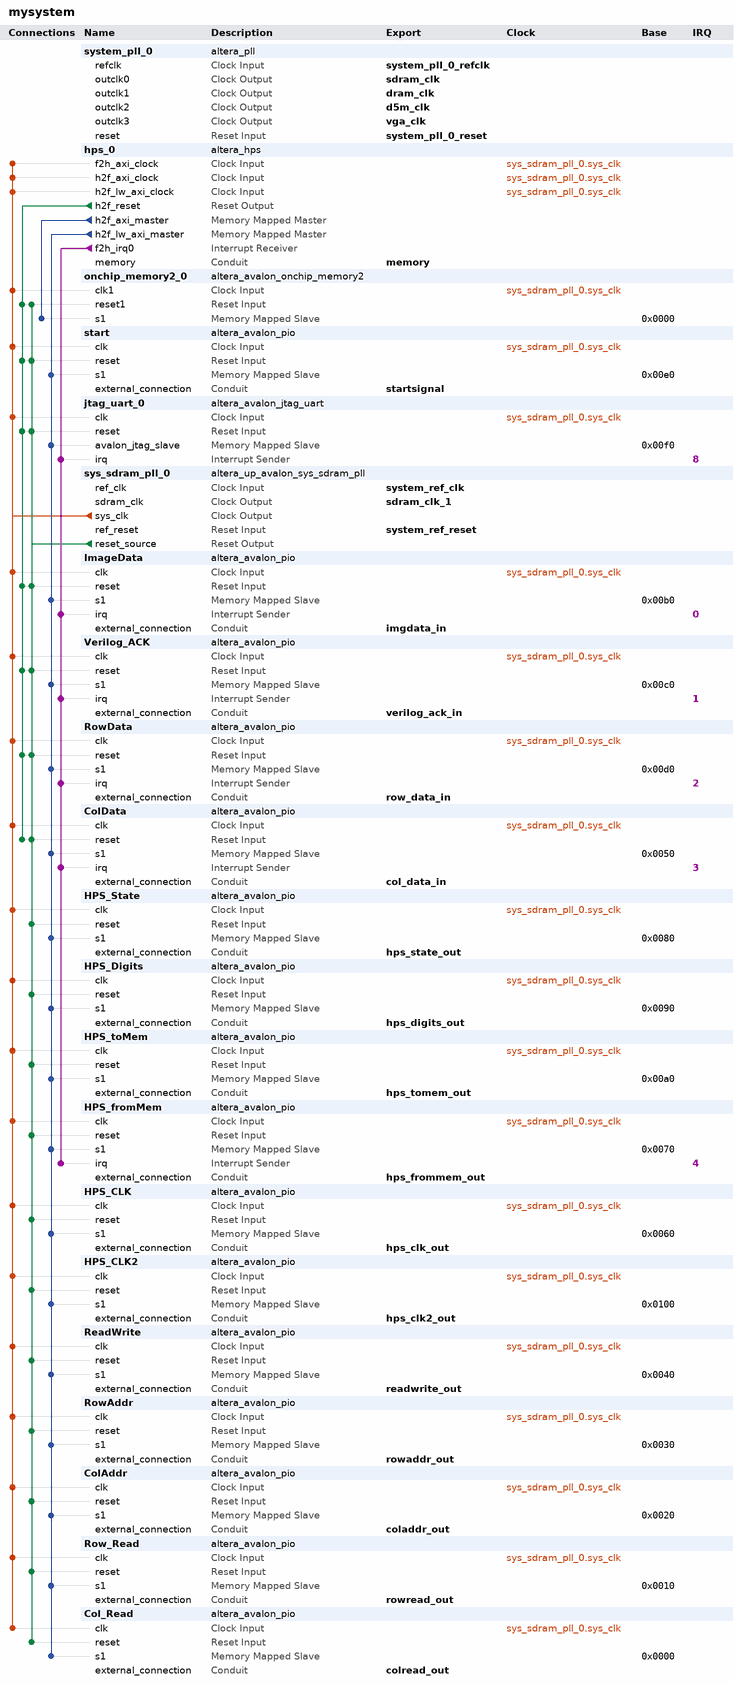
[diagram p0: system contents]
# Platform Designer (Qsys) system mysystem, Cyclone V 5CSEMA5F31C6
# Parameters at their usual value, and those the tool derives, are not listed.
package require -exact qsys 13.1
create_system mysystem
set_project_property DEVICE_FAMILY {Cyclone V}
set_project_property DEVICE 5CSEMA5F31C6

add_instance system_pll_0 altera_pll 13.1
set_instance_parameter_value system_pll_0 gui_device_speed_grade 2
set_instance_parameter_value system_pll_0 gui_pll_mode {Integer-N PLL}
set_instance_parameter_value system_pll_0 gui_reference_clock_frequency 50.0
set_instance_parameter_value system_pll_0 gui_operation_mode direct
set_instance_parameter_value system_pll_0 gui_use_locked false
set_instance_parameter_value system_pll_0 gui_number_of_clocks 4
set_instance_parameter_value system_pll_0 gui_output_clock_frequency0 100.0
set_instance_parameter_value system_pll_0 gui_output_clock_frequency1 100.0
set_instance_parameter_value system_pll_0 gui_ps_units1 degrees
set_instance_parameter_value system_pll_0 gui_phase_shift_deg1 -90.0
set_instance_parameter_value system_pll_0 gui_output_clock_frequency2 25.0
set_instance_parameter_value system_pll_0 gui_output_clock_frequency3 25.0

add_instance hps_0 altera_hps 13.1
set_instance_parameter_value hps_0 MEM_VENDOR JEDEC
set_instance_parameter_value hps_0 MEM_CLK_FREQ_MAX 400.0
set_instance_parameter_value hps_0 MEM_ROW_ADDR_WIDTH 12
set_instance_parameter_value hps_0 MEM_COL_ADDR_WIDTH 8
set_instance_parameter_value hps_0 MEM_DQ_WIDTH 8
set_instance_parameter_value hps_0 MEM_BANKADDR_WIDTH 3
set_instance_parameter_value hps_0 MEM_DRV_STR RZQ/6
set_instance_parameter_value hps_0 MEM_RTT_NOM RZQ/6
set_instance_parameter_value hps_0 MEM_RTT_WR {Dynamic ODT off}
set_instance_parameter_value hps_0 MEM_WTCL 6
set_instance_parameter_value hps_0 MEM_TCL 7
set_instance_parameter_value hps_0 TIMING_TIS 175
set_instance_parameter_value hps_0 TIMING_TIH 250
set_instance_parameter_value hps_0 TIMING_TDS 50
set_instance_parameter_value hps_0 TIMING_TDH 125
set_instance_parameter_value hps_0 TIMING_TDQSQ 120
set_instance_parameter_value hps_0 TIMING_TDQSCK 400
set_instance_parameter_value hps_0 TIMING_TQSH 0.38
set_instance_parameter_value hps_0 MEM_TINIT_US 499
set_instance_parameter_value hps_0 MEM_TMRD_CK 3
set_instance_parameter_value hps_0 MEM_TRAS_NS 40.0
set_instance_parameter_value hps_0 MEM_TRCD_NS 15.0
set_instance_parameter_value hps_0 MEM_TRP_NS 15.0
set_instance_parameter_value hps_0 MEM_TREFI_US 7.0
set_instance_parameter_value hps_0 MEM_TRFC_NS 75.0
set_instance_parameter_value hps_0 MEM_TWTR 2
set_instance_parameter_value hps_0 MEM_TFAW_NS 37.5
set_instance_parameter_value hps_0 REF_CLK_FREQ 125.0
set_instance_parameter_value hps_0 DEFAULT_FAST_SIM_MODEL true
set_instance_parameter_value hps_0 TIMING_BOARD_MAX_CK_DELAY 0.6
set_instance_parameter_value hps_0 TIMING_BOARD_MAX_DQS_DELAY 0.6
set_instance_parameter_value hps_0 TIMING_BOARD_SKEW_CKDQS_DIMM_MIN -0.01
set_instance_parameter_value hps_0 TIMING_BOARD_SKEW_CKDQS_DIMM_MAX 0.01
set_instance_parameter_value hps_0 TIMING_BOARD_SKEW_WITHIN_DQS 0.02
set_instance_parameter_value hps_0 TIMING_BOARD_SKEW_BETWEEN_DQS 0.02
set_instance_parameter_value hps_0 TIMING_BOARD_DQ_TO_DQS_SKEW 0.0
set_instance_parameter_value hps_0 TIMING_BOARD_AC_SKEW 0.02
set_instance_parameter_value hps_0 TIMING_BOARD_AC_TO_CK_SKEW 0.0
set_instance_parameter_value hps_0 MEM_CLK_FREQ 300.0
set_instance_parameter_value hps_0 HPS_PROTOCOL DDR3
set_instance_parameter_value hps_0 STM_Enable false
set_instance_parameter_value hps_0 F2S_Width 2
set_instance_parameter_value hps_0 S2F_Width 3
set_instance_parameter_value hps_0 LWH2F_Enable true
set_instance_parameter_value hps_0 F2SCLK_DBGRST_Enable false
set_instance_parameter_value hps_0 F2SCLK_WARMRST_Enable false
set_instance_parameter_value hps_0 F2SCLK_COLDRST_Enable false
set_instance_parameter_value hps_0 F2SINTERRUPT_Enable true
set_instance_parameter_value hps_0 EMAC1_PinMuxing Unused
set_instance_parameter_value hps_0 EMAC1_Mode N/A
set_instance_parameter_value hps_0 QSPI_PinMuxing Unused
set_instance_parameter_value hps_0 QSPI_Mode N/A
set_instance_parameter_value hps_0 SDIO_PinMuxing Unused
set_instance_parameter_value hps_0 SDIO_Mode N/A
set_instance_parameter_value hps_0 USB1_PinMuxing Unused
set_instance_parameter_value hps_0 USB1_Mode N/A
set_instance_parameter_value hps_0 SPIM1_PinMuxing Unused
set_instance_parameter_value hps_0 SPIM1_Mode N/A
set_instance_parameter_value hps_0 UART0_PinMuxing Unused
set_instance_parameter_value hps_0 UART0_Mode N/A
set_instance_parameter_value hps_0 I2C0_PinMuxing Unused
set_instance_parameter_value hps_0 I2C0_Mode N/A
set_instance_parameter_value hps_0 I2C1_PinMuxing Unused
set_instance_parameter_value hps_0 I2C1_Mode N/A
set_instance_parameter_value hps_0 S2FCLK_USER1CLK_FREQ 100
set_instance_parameter_value hps_0 FPGA_PERIPHERAL_OUTPUT_CLOCK_FREQ_EMAC0_MD_CLK 100
set_instance_parameter_value hps_0 FPGA_PERIPHERAL_OUTPUT_CLOCK_FREQ_EMAC0_GTX_CLK 100
set_instance_parameter_value hps_0 FPGA_PERIPHERAL_OUTPUT_CLOCK_FREQ_EMAC1_MD_CLK 100
set_instance_parameter_value hps_0 FPGA_PERIPHERAL_OUTPUT_CLOCK_FREQ_EMAC1_GTX_CLK 100

add_instance onchip_memory2_0 altera_avalon_onchip_memory2 13.1
set_instance_parameter_value onchip_memory2_0 dataWidth 32
set_instance_parameter_value onchip_memory2_0 dualPort false
set_instance_parameter_value onchip_memory2_0 initMemContent true
set_instance_parameter_value onchip_memory2_0 initializationFileName onchip_mem.hex
set_instance_parameter_value onchip_memory2_0 memorySize 16384

add_instance start altera_avalon_pio 13.1
set_instance_parameter_value start direction Output
set_instance_parameter_value start width 1

add_instance jtag_uart_0 altera_avalon_jtag_uart 13.1
set_instance_parameter_value jtag_uart_0 simInteractiveOptions NO_INTERACTIVE_WINDOWS

add_instance sys_sdram_pll_0 altera_up_avalon_sys_sdram_pll 13.1
set_instance_parameter_value sys_sdram_pll_0 gui_refclk 50.0
set_instance_parameter_value sys_sdram_pll_0 gui_outclk 50.0
set_instance_parameter_value sys_sdram_pll_0 CV_boards DE1-SoC

add_instance ImageData altera_avalon_pio 13.1
set_instance_parameter_value ImageData bitClearingEdgeCapReg true
set_instance_parameter_value ImageData captureEdge true
set_instance_parameter_value ImageData direction Input
set_instance_parameter_value ImageData edgeType FALLING
set_instance_parameter_value ImageData generateIRQ true
set_instance_parameter_value ImageData irqType EDGE
set_instance_parameter_value ImageData simDoTestBenchWiring true
set_instance_parameter_value ImageData width 32

add_instance Verilog_ACK altera_avalon_pio 13.1
set_instance_parameter_value Verilog_ACK bitClearingEdgeCapReg true
set_instance_parameter_value Verilog_ACK captureEdge true
set_instance_parameter_value Verilog_ACK direction Input
set_instance_parameter_value Verilog_ACK edgeType FALLING
set_instance_parameter_value Verilog_ACK generateIRQ true
set_instance_parameter_value Verilog_ACK irqType EDGE
set_instance_parameter_value Verilog_ACK simDoTestBenchWiring true
set_instance_parameter_value Verilog_ACK width 1

add_instance RowData altera_avalon_pio 13.1
set_instance_parameter_value RowData bitClearingEdgeCapReg true
set_instance_parameter_value RowData captureEdge true
set_instance_parameter_value RowData direction Input
set_instance_parameter_value RowData edgeType FALLING
set_instance_parameter_value RowData generateIRQ true
set_instance_parameter_value RowData irqType EDGE
set_instance_parameter_value RowData simDoTestBenchWiring true
set_instance_parameter_value RowData width 32

add_instance ColData altera_avalon_pio 13.1
set_instance_parameter_value ColData bitClearingEdgeCapReg true
set_instance_parameter_value ColData captureEdge true
set_instance_parameter_value ColData direction Input
set_instance_parameter_value ColData edgeType FALLING
set_instance_parameter_value ColData generateIRQ true
set_instance_parameter_value ColData irqType EDGE
set_instance_parameter_value ColData simDoTestBenchWiring true
set_instance_parameter_value ColData width 32

add_instance HPS_State altera_avalon_pio 13.1
set_instance_parameter_value HPS_State direction Output
set_instance_parameter_value HPS_State width 10

add_instance HPS_Digits altera_avalon_pio 13.1
set_instance_parameter_value HPS_Digits direction Output
set_instance_parameter_value HPS_Digits width 32

add_instance HPS_toMem altera_avalon_pio 13.1
set_instance_parameter_value HPS_toMem direction Output
set_instance_parameter_value HPS_toMem width 32

add_instance HPS_fromMem altera_avalon_pio 13.1
set_instance_parameter_value HPS_fromMem bitClearingEdgeCapReg true
set_instance_parameter_value HPS_fromMem captureEdge true
set_instance_parameter_value HPS_fromMem direction Input
set_instance_parameter_value HPS_fromMem edgeType FALLING
set_instance_parameter_value HPS_fromMem generateIRQ true
set_instance_parameter_value HPS_fromMem irqType EDGE
set_instance_parameter_value HPS_fromMem simDoTestBenchWiring true
set_instance_parameter_value HPS_fromMem width 32

add_instance HPS_CLK altera_avalon_pio 13.1
set_instance_parameter_value HPS_CLK direction Output
set_instance_parameter_value HPS_CLK width 1

add_instance HPS_CLK2 altera_avalon_pio 13.1
set_instance_parameter_value HPS_CLK2 direction Output
set_instance_parameter_value HPS_CLK2 width 1

add_instance ReadWrite altera_avalon_pio 13.1
set_instance_parameter_value ReadWrite direction Output
set_instance_parameter_value ReadWrite width 1

add_instance RowAddr altera_avalon_pio 13.1
set_instance_parameter_value RowAddr direction Output
set_instance_parameter_value RowAddr width 10

add_instance ColAddr altera_avalon_pio 13.1
set_instance_parameter_value ColAddr direction Output
set_instance_parameter_value ColAddr width 10

add_instance Row_Read altera_avalon_pio 13.1
set_instance_parameter_value Row_Read direction Output
set_instance_parameter_value Row_Read width 1

add_instance Col_Read altera_avalon_pio 13.1
set_instance_parameter_value Col_Read direction Output
set_instance_parameter_value Col_Read width 1

# connections
add_connection sys_sdram_pll_0.sys_clk Col_Read.clk clock
add_connection sys_sdram_pll_0.sys_clk ColAddr.clk clock
add_connection sys_sdram_pll_0.sys_clk ColData.clk clock
add_connection sys_sdram_pll_0.sys_clk hps_0.f2h_axi_clock clock
add_connection sys_sdram_pll_0.sys_clk hps_0.h2f_axi_clock clock
add_connection sys_sdram_pll_0.sys_clk hps_0.h2f_lw_axi_clock clock
add_connection sys_sdram_pll_0.sys_clk HPS_CLK2.clk clock
add_connection sys_sdram_pll_0.sys_clk HPS_CLK.clk clock
add_connection sys_sdram_pll_0.sys_clk HPS_Digits.clk clock
add_connection sys_sdram_pll_0.sys_clk HPS_fromMem.clk clock
add_connection sys_sdram_pll_0.sys_clk HPS_State.clk clock
add_connection sys_sdram_pll_0.sys_clk HPS_toMem.clk clock
add_connection sys_sdram_pll_0.sys_clk ImageData.clk clock
add_connection sys_sdram_pll_0.sys_clk jtag_uart_0.clk clock
add_connection sys_sdram_pll_0.sys_clk onchip_memory2_0.clk1 clock
add_connection sys_sdram_pll_0.sys_clk ReadWrite.clk clock
add_connection sys_sdram_pll_0.sys_clk Row_Read.clk clock
add_connection sys_sdram_pll_0.sys_clk RowAddr.clk clock
add_connection sys_sdram_pll_0.sys_clk RowData.clk clock
add_connection sys_sdram_pll_0.sys_clk start.clk clock
add_connection sys_sdram_pll_0.sys_clk Verilog_ACK.clk clock
add_connection hps_0.h2f_reset ColData.reset reset
add_connection hps_0.h2f_reset ImageData.reset reset
add_connection hps_0.h2f_reset jtag_uart_0.reset reset
add_connection hps_0.h2f_reset onchip_memory2_0.reset1 reset
add_connection hps_0.h2f_reset RowData.reset reset
add_connection hps_0.h2f_reset start.reset reset
add_connection hps_0.h2f_reset Verilog_ACK.reset reset
add_connection sys_sdram_pll_0.reset_source Col_Read.reset reset
add_connection sys_sdram_pll_0.reset_source ColAddr.reset reset
add_connection sys_sdram_pll_0.reset_source ColData.reset reset
add_connection sys_sdram_pll_0.reset_source HPS_CLK2.reset reset
add_connection sys_sdram_pll_0.reset_source HPS_CLK.reset reset
add_connection sys_sdram_pll_0.reset_source HPS_Digits.reset reset
add_connection sys_sdram_pll_0.reset_source HPS_fromMem.reset reset
add_connection sys_sdram_pll_0.reset_source HPS_State.reset reset
add_connection sys_sdram_pll_0.reset_source HPS_toMem.reset reset
add_connection sys_sdram_pll_0.reset_source ImageData.reset reset
add_connection sys_sdram_pll_0.reset_source jtag_uart_0.reset reset
add_connection sys_sdram_pll_0.reset_source onchip_memory2_0.reset1 reset
add_connection sys_sdram_pll_0.reset_source ReadWrite.reset reset
add_connection sys_sdram_pll_0.reset_source Row_Read.reset reset
add_connection sys_sdram_pll_0.reset_source RowAddr.reset reset
add_connection sys_sdram_pll_0.reset_source RowData.reset reset
add_connection sys_sdram_pll_0.reset_source start.reset reset
add_connection sys_sdram_pll_0.reset_source Verilog_ACK.reset reset
add_connection hps_0.h2f_axi_master onchip_memory2_0.s1 avalon
set_connection_parameter_value hps_0.h2f_axi_master/onchip_memory2_0.s1 baseAddress 0x0000
add_connection hps_0.h2f_lw_axi_master Col_Read.s1 avalon
set_connection_parameter_value hps_0.h2f_lw_axi_master/Col_Read.s1 baseAddress 0x0000
add_connection hps_0.h2f_lw_axi_master ColAddr.s1 avalon
set_connection_parameter_value hps_0.h2f_lw_axi_master/ColAddr.s1 baseAddress 0x0020
add_connection hps_0.h2f_lw_axi_master ColData.s1 avalon
set_connection_parameter_value hps_0.h2f_lw_axi_master/ColData.s1 baseAddress 0x0050
add_connection hps_0.h2f_lw_axi_master HPS_CLK2.s1 avalon
set_connection_parameter_value hps_0.h2f_lw_axi_master/HPS_CLK2.s1 baseAddress 0x0100
add_connection hps_0.h2f_lw_axi_master HPS_CLK.s1 avalon
set_connection_parameter_value hps_0.h2f_lw_axi_master/HPS_CLK.s1 baseAddress 0x0060
add_connection hps_0.h2f_lw_axi_master HPS_Digits.s1 avalon
set_connection_parameter_value hps_0.h2f_lw_axi_master/HPS_Digits.s1 baseAddress 0x0090
add_connection hps_0.h2f_lw_axi_master HPS_fromMem.s1 avalon
set_connection_parameter_value hps_0.h2f_lw_axi_master/HPS_fromMem.s1 baseAddress 0x0070
add_connection hps_0.h2f_lw_axi_master HPS_State.s1 avalon
set_connection_parameter_value hps_0.h2f_lw_axi_master/HPS_State.s1 baseAddress 0x0080
add_connection hps_0.h2f_lw_axi_master HPS_toMem.s1 avalon
set_connection_parameter_value hps_0.h2f_lw_axi_master/HPS_toMem.s1 baseAddress 0x00a0
add_connection hps_0.h2f_lw_axi_master ImageData.s1 avalon
set_connection_parameter_value hps_0.h2f_lw_axi_master/ImageData.s1 baseAddress 0x00b0
add_connection hps_0.h2f_lw_axi_master jtag_uart_0.avalon_jtag_slave avalon
set_connection_parameter_value hps_0.h2f_lw_axi_master/jtag_uart_0.avalon_jtag_slave baseAddress 0x00f0
add_connection hps_0.h2f_lw_axi_master ReadWrite.s1 avalon
set_connection_parameter_value hps_0.h2f_lw_axi_master/ReadWrite.s1 baseAddress 0x0040
add_connection hps_0.h2f_lw_axi_master Row_Read.s1 avalon
set_connection_parameter_value hps_0.h2f_lw_axi_master/Row_Read.s1 baseAddress 0x0010
add_connection hps_0.h2f_lw_axi_master RowAddr.s1 avalon
set_connection_parameter_value hps_0.h2f_lw_axi_master/RowAddr.s1 baseAddress 0x0030
add_connection hps_0.h2f_lw_axi_master RowData.s1 avalon
set_connection_parameter_value hps_0.h2f_lw_axi_master/RowData.s1 baseAddress 0x00d0
add_connection hps_0.h2f_lw_axi_master start.s1 avalon
set_connection_parameter_value hps_0.h2f_lw_axi_master/start.s1 baseAddress 0x00e0
add_connection hps_0.h2f_lw_axi_master Verilog_ACK.s1 avalon
set_connection_parameter_value hps_0.h2f_lw_axi_master/Verilog_ACK.s1 baseAddress 0x00c0
add_connection hps_0.f2h_irq0 ColData.irq interrupt
set_connection_parameter_value hps_0.f2h_irq0/ColData.irq irqNumber 3
add_connection hps_0.f2h_irq0 HPS_fromMem.irq interrupt
set_connection_parameter_value hps_0.f2h_irq0/HPS_fromMem.irq irqNumber 4
add_connection hps_0.f2h_irq0 ImageData.irq interrupt
set_connection_parameter_value hps_0.f2h_irq0/ImageData.irq irqNumber 0
add_connection hps_0.f2h_irq0 jtag_uart_0.irq interrupt
set_connection_parameter_value hps_0.f2h_irq0/jtag_uart_0.irq irqNumber 8
add_connection hps_0.f2h_irq0 RowData.irq interrupt
set_connection_parameter_value hps_0.f2h_irq0/RowData.irq irqNumber 2
add_connection hps_0.f2h_irq0 Verilog_ACK.irq interrupt
set_connection_parameter_value hps_0.f2h_irq0/Verilog_ACK.irq irqNumber 1

# exported interfaces
add_interface sdram_clk clock source
set_interface_property sdram_clk EXPORT_OF system_pll_0.outclk0
add_interface dram_clk clock source
set_interface_property dram_clk EXPORT_OF system_pll_0.outclk1
add_interface d5m_clk clock source
set_interface_property d5m_clk EXPORT_OF system_pll_0.outclk2
add_interface vga_clk clock source
set_interface_property vga_clk EXPORT_OF system_pll_0.outclk3
add_interface system_pll_0_refclk clock sink
set_interface_property system_pll_0_refclk EXPORT_OF system_pll_0.refclk
add_interface system_pll_0_reset reset sink
set_interface_property system_pll_0_reset EXPORT_OF system_pll_0.reset
add_interface memory conduit end
set_interface_property memory EXPORT_OF hps_0.memory
add_interface startsignal conduit end
set_interface_property startsignal EXPORT_OF start.external_connection
add_interface system_ref_clk clock sink
set_interface_property system_ref_clk EXPORT_OF sys_sdram_pll_0.ref_clk
add_interface sdram_clk_1 clock source
set_interface_property sdram_clk_1 EXPORT_OF sys_sdram_pll_0.sdram_clk
add_interface system_ref_reset reset sink
set_interface_property system_ref_reset EXPORT_OF sys_sdram_pll_0.ref_reset
add_interface imgdata_in conduit end
set_interface_property imgdata_in EXPORT_OF ImageData.external_connection
add_interface verilog_ack_in conduit end
set_interface_property verilog_ack_in EXPORT_OF Verilog_ACK.external_connection
add_interface row_data_in conduit end
set_interface_property row_data_in EXPORT_OF RowData.external_connection
add_interface hps_state_out conduit end
set_interface_property hps_state_out EXPORT_OF HPS_State.external_connection
add_interface hps_tomem_out conduit end
set_interface_property hps_tomem_out EXPORT_OF HPS_toMem.external_connection
add_interface hps_frommem_out conduit end
set_interface_property hps_frommem_out EXPORT_OF HPS_fromMem.external_connection
add_interface hps_digits_out conduit end
set_interface_property hps_digits_out EXPORT_OF HPS_Digits.external_connection
add_interface hps_clk_out conduit end
set_interface_property hps_clk_out EXPORT_OF HPS_CLK.external_connection
add_interface col_data_in conduit end
set_interface_property col_data_in EXPORT_OF ColData.external_connection
add_interface readwrite_out conduit end
set_interface_property readwrite_out EXPORT_OF ReadWrite.external_connection
add_interface rowaddr_out conduit end
set_interface_property rowaddr_out EXPORT_OF RowAddr.external_connection
add_interface coladdr_out conduit end
set_interface_property coladdr_out EXPORT_OF ColAddr.external_connection
add_interface rowread_out conduit end
set_interface_property rowread_out EXPORT_OF Row_Read.external_connection
add_interface colread_out conduit end
set_interface_property colread_out EXPORT_OF Col_Read.external_connection
add_interface hps_clk2_out conduit end
set_interface_property hps_clk2_out EXPORT_OF HPS_CLK2.external_connection

set_interconnect_requirement {$system} qsys_mm.clockCrossingAdapter HANDSHAKE
set_interconnect_requirement {$system} qsys_mm.maxAdditionalLatency 1
set_interconnect_requirement {$system} qsys_mm.insertDefaultSlave false

save_system mysystem.qsys
